# EAGLE design XBeeBoosterPack (EAGLE 6.5.0)
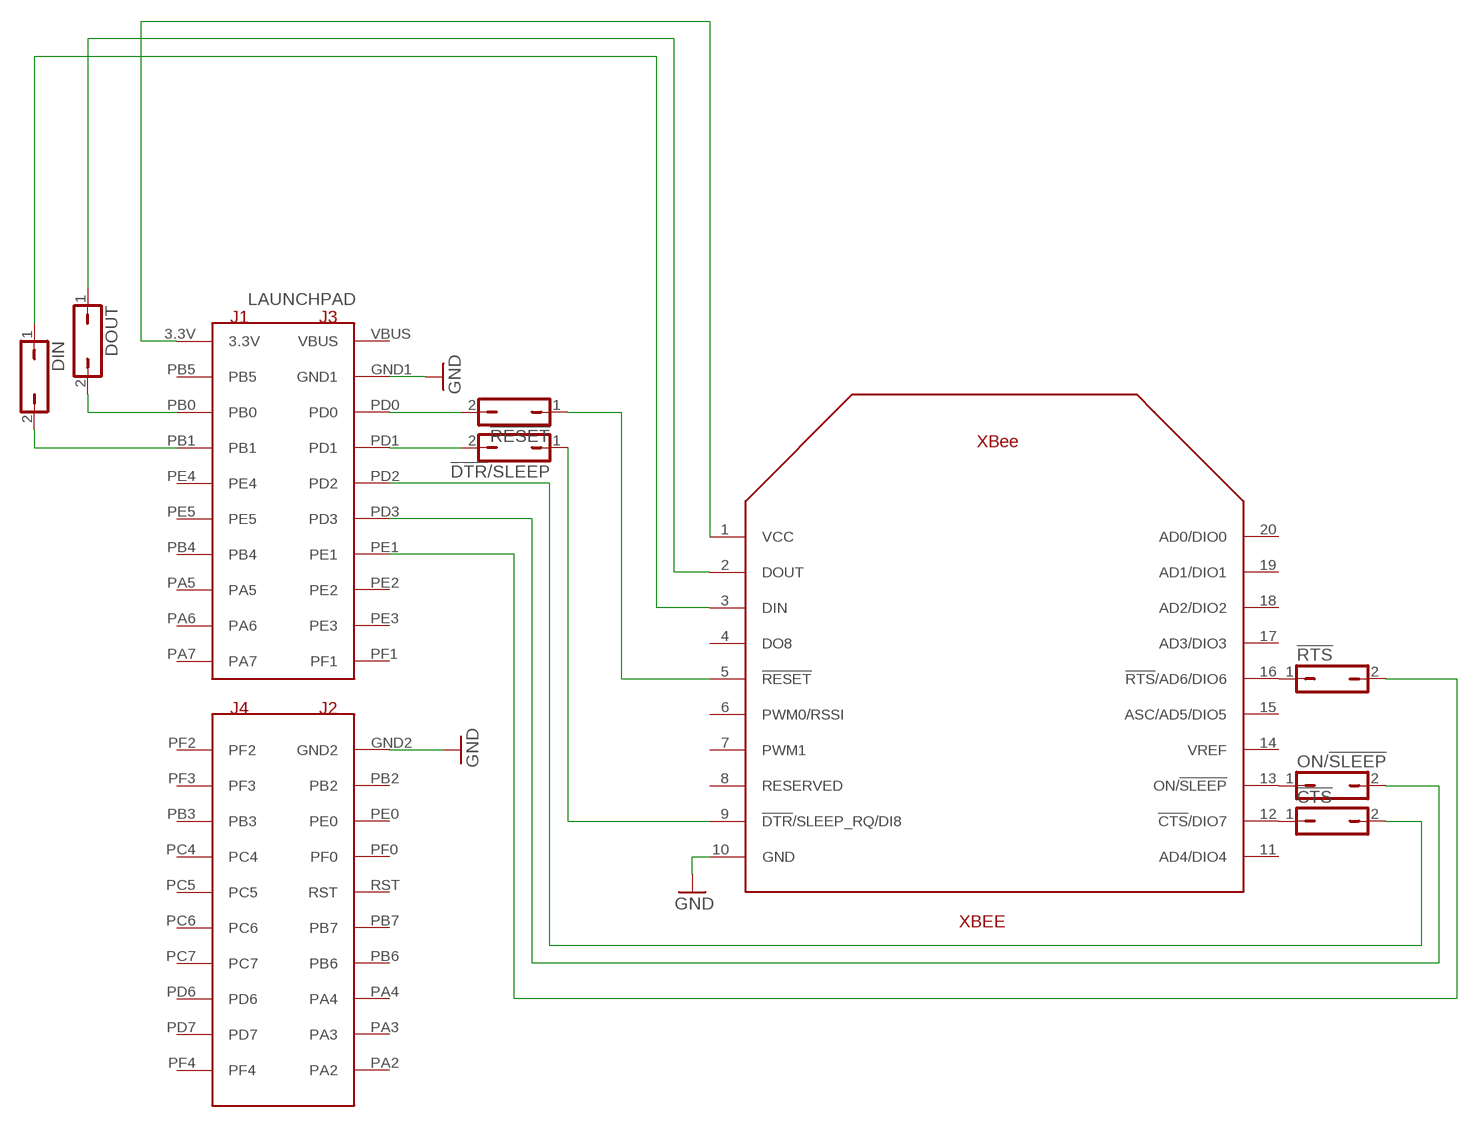
[diagram p0: schematic, sheet 1]

## Parts
!CTS!  JP1Q  [JP1]
!DTR!/SLEEP  JP1Q  [JP1]
!RESET  JP1Q  [JP1]
!RTS!  JP1Q  [JP1]
DIN  JP1Q  [JP1]
DOUT  JP1Q  [JP1]
LAUNCHPAD  STELLARIS_LAUNCHPAD_BLIZZARD_XL_HEADERS  [STELLARISLAUNCHPADHEADERS]
ON/!SLEEP!  JP1Q  [JP1]
XBEE  XBEE_HEADERS  [XBEE_HEADERS]

## Nets
GND: LAUNCHPAD.GND1 LAUNCHPAD.GND2 XBEE.10(GND)
N$1: DOUT.1 XBEE.2(DOUT)
N$2: LAUNCHPAD.3.3V XBEE.1(VCC)
N$3: DOUT.2 LAUNCHPAD.PB0
N$4: DIN.1 XBEE.3(DIN)
N$5: DIN.2 LAUNCHPAD.PB1
N$6: !RESET.2 LAUNCHPAD.PD0
N$7: !RESET.1 XBEE.5(!RESET)
N$8: !DTR!/SLEEP.2 LAUNCHPAD.PD1
N$10: !DTR!/SLEEP.1 XBEE.9(!DTR!/SLEEP_RQ/DI8)
N$13: !RTS!.1 XBEE.16(!RTS!/AD6/DIO6)
N$14: ON/!SLEEP!.1 XBEE.13(ON/!SLEEP!)
N$15: !CTS!.1 XBEE.12(!CTS!/DIO7)
N$16: !CTS!.2 LAUNCHPAD.PD2
N$17: LAUNCHPAD.PD3 ON/!SLEEP!.2
N$18: !RTS!.2 LAUNCHPAD.PE1
Unconnected: LAUNCHPAD.PA2 LAUNCHPAD.PA3 LAUNCHPAD.PA4 LAUNCHPAD.PA5 LAUNCHPAD.PA6 LAUNCHPAD.PA7 LAUNCHPAD.PB2 LAUNCHPAD.PB3 LAUNCHPAD.PB4 LAUNCHPAD.PB5 LAUNCHPAD.PB6 LAUNCHPAD.PB7 LAUNCHPAD.PC4 LAUNCHPAD.PC5 LAUNCHPAD.PC6 LAUNCHPAD.PC7 LAUNCHPAD.PD6 LAUNCHPAD.PD7 LAUNCHPAD.PE0 LAUNCHPAD.PE2 LAUNCHPAD.PE3 LAUNCHPAD.PE4 LAUNCHPAD.PE5 LAUNCHPAD.PF0 LAUNCHPAD.PF1 LAUNCHPAD.PF2 LAUNCHPAD.PF3 LAUNCHPAD.PF4 XBEE.4(DO8) XBEE.6(PWM0/RSSI) XBEE.7(PWM1) XBEE.8(RESERVED) XBEE.11(AD4/DIO4) XBEE.14(VREF) XBEE.15(ASC/AD5/DIO5) XBEE.17(AD3/DIO3) XBEE.18(AD2/DIO2) XBEE.19(AD1/DIO1) XBEE.20(AD0/DIO0)

## Power pins joined to a net without a drawn wire
RST: LAUNCHPAD.RST
VBUS: LAUNCHPAD.VBUS

## Library data of the parts
!CTS! !DTR!/SLEEP !RESET !RTS! DIN DOUT ON/!SLEEP! = jumper:JP1Q: JUMPER
LAUNCHPAD = AustinBlackstoneEngineeringPublic:STELLARIS_LAUNCHPAD_BLIZZARD_XL_HEADERS: Headers for Blizzard Chipline Stellaris Launchpad XL Booster Packs. Compatible with the EK-LM4F120XL and EK-TM4C123GXL Launchpads. This header can be used to set the headers correctly spaced. The rest of the board should be based around these headers headers that fit these can be ordered from Samtec.com Part Number SSW-110-23-S-D
XBEE = AustinBlackstoneEngineeringPublic:XBEE_HEADERS: XBee S1 / XBee Pro

## Board
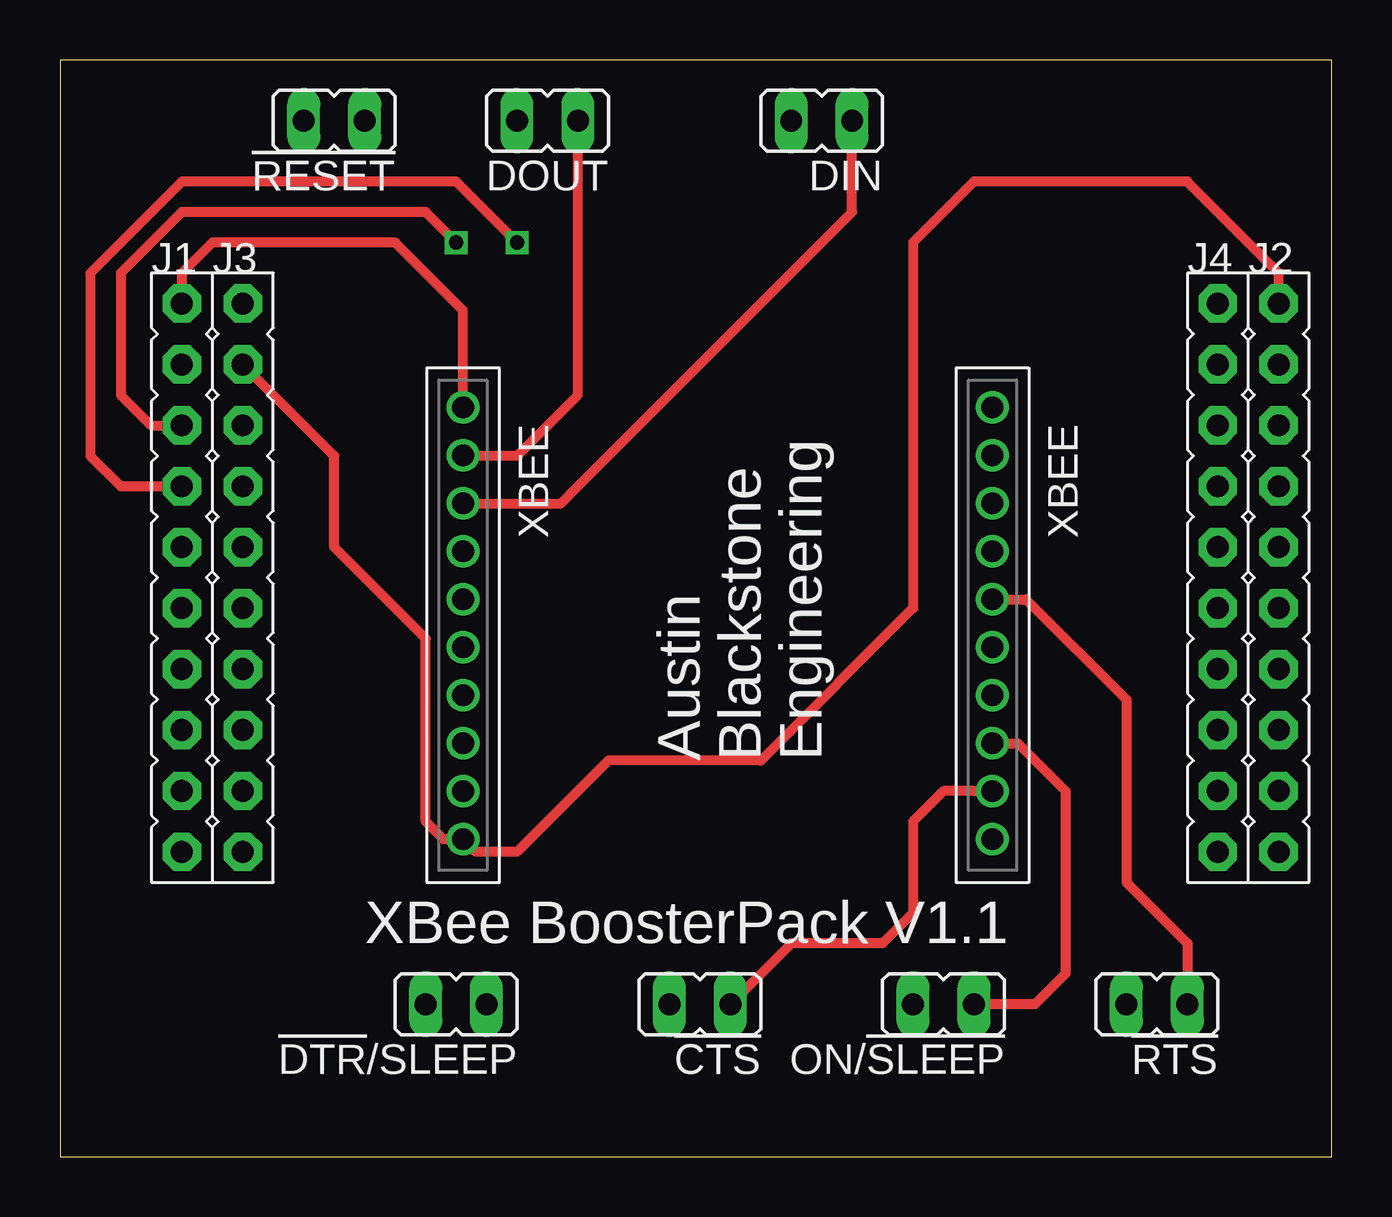
[diagram p1: board, top side]
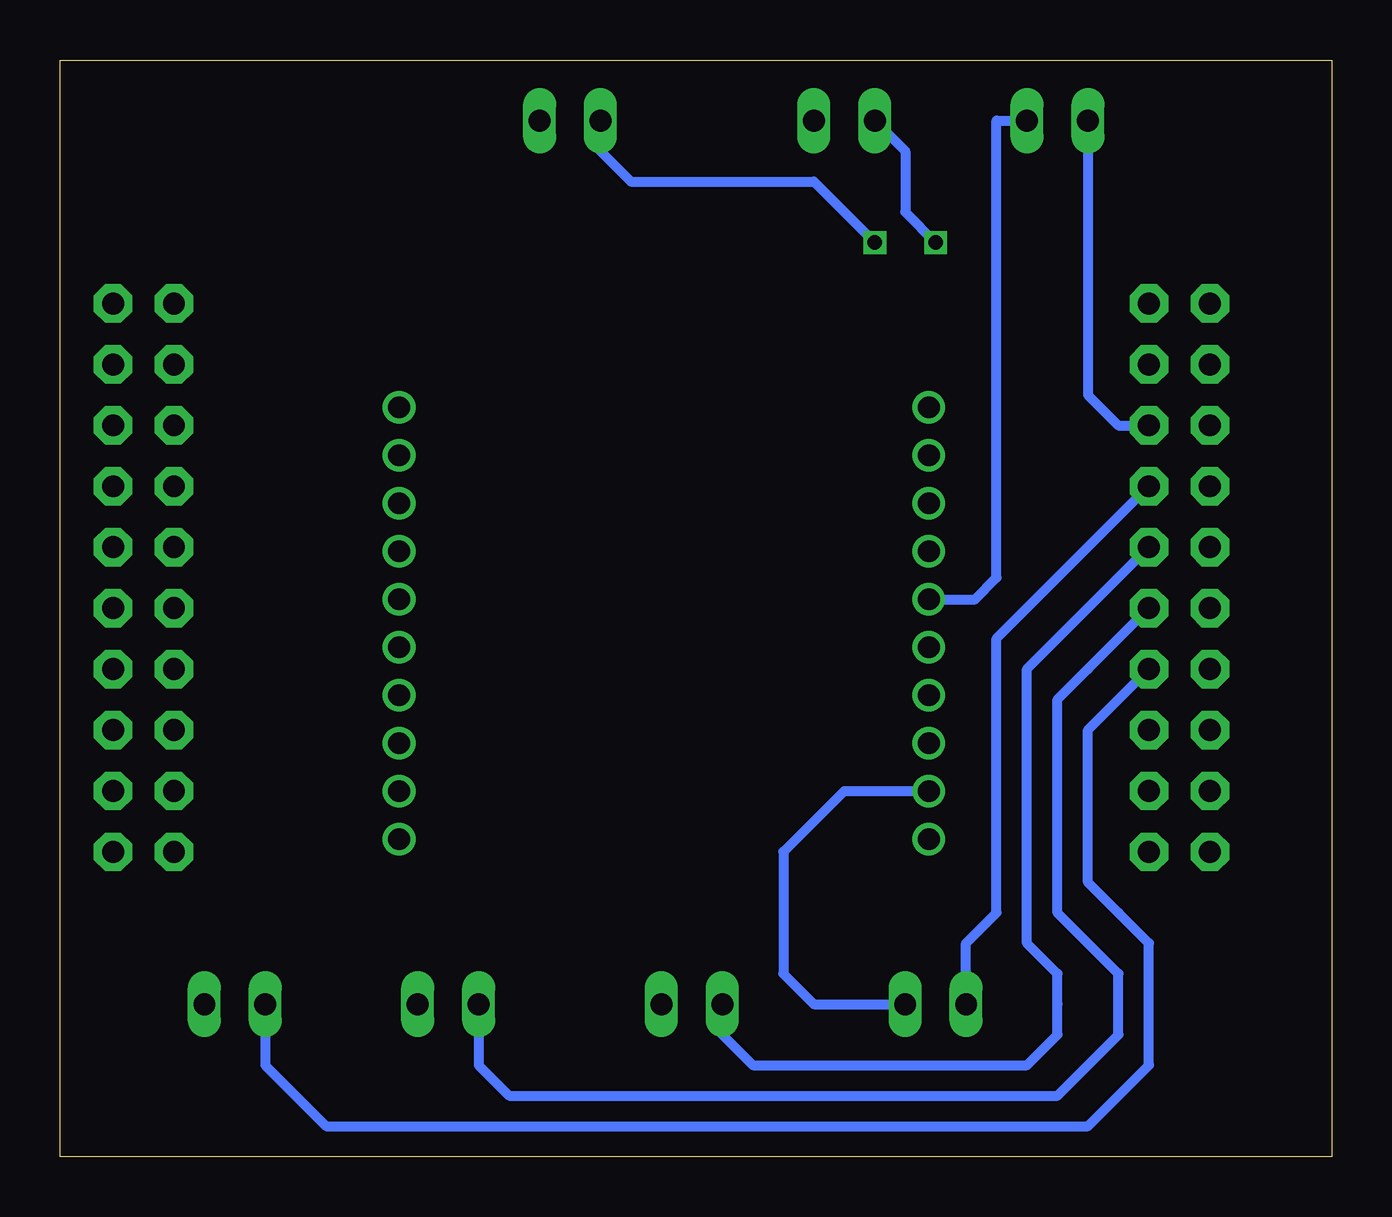
[diagram p2: board, bottom side, seen from below]

Size 53.01 x 45.71 mm. Coordinates in mm from the lower left corner, seen from the top.
Outline: 0,0 53.01,0 53.01,45.71 0,45.71 0,0
Copper layers (1*16): Top 0.0356mm / dielectric 1.5011mm / Bottom 0.0356mm
Design rules "LaenPCBOrder": minimum track width 6mil, minimum drill 13mil, track to track 6mil, track to pad 6mil, pad to pad 6mil, via to via 6mil, smd to smd 6mil, copper to edge 15mil, drill to drill 6mil, minimum pad ring 7mil, minimum via ring 7mil, stop-mask expansion 4mil, vias tented up to drill 0mil, thermal gap 10mil

### Footprints (pad centres in the part's own frame; a part is rotated, then mirrored left to right if it is on the bottom)
JP1 = drill 0.914 long: 1 0,-1.27; 2 0,1.27
STELLARISLAUNCHPADHEADERS = drill 0.914 pad 1.6 octagon: 3.3V -22.86,13.97; GND1 -20.32,11.43; GND2 22.86,13.97; PA2 22.86,-8.89; PA3 22.86,-6.35; PA4 22.86,-3.81; PA5 -22.86,-3.81; PA6 -22.86,-6.35; PA7 -22.86,-8.89; PB0 -22.86,8.89; PB1 -22.86,6.35; PB2 22.86,11.43; PB3 20.32,8.89; PB4 -22.86,-1.27; PB5 -22.86,11.43; PB6 22.86,-1.27; PB7 22.86,1.27; PC4 20.32,6.35; PC5 20.32,3.81; PC6 20.32,1.27; PC7 20.32,-1.27; PD0 -20.32,8.89; PD1 -20.32,6.35; PD2 -20.32,3.81; PD3 -20.32,1.27; PD6 20.32,-3.81; PD7 20.32,-6.35; PE0 22.86,8.89; PE1 -20.32,-1.27; PE2 -20.32,-3.81; PE3 -20.32,-6.35; PE4 -22.86,3.81; PE5 -22.86,1.27; PF0 22.86,6.35; PF1 -20.32,-8.89; PF2 20.32,13.97; PF3 20.32,11.43; PF4 20.32,-8.89; RST 22.86,3.81; VBUS -20.32,13.97
XBEE_HEADERS = drill 0.914 pad 1.372: 1 1.56,19.8; 2 1.56,17.8; 3 1.56,15.8; 4 1.56,13.8; 5 1.56,11.8; 6 1.56,9.8; 7 1.56,7.8; 8 1.56,5.8; 9 1.56,3.8; 10 1.56,1.8; 11 23.63,1.8; 12 23.63,3.8; 13 23.63,5.8; 14 23.63,7.8; 15 23.63,9.8; 16 23.63,11.8; 17 23.63,13.8; 18 23.63,15.8; 19 23.63,17.8; 20 23.63,19.8

### Placement (x,y rotation side)
!CTS!  26.67,6.35 90 top
!DTR!/SLEEP  16.51,6.35 90 top
!RESET  11.43,43.18 90 top
!RTS!  45.72,6.35 90 top
DIN  31.75,43.18 90 top
DOUT  20.32,43.18 90 top
LAUNCHPAD  27.94,21.59 0 top
ON/!SLEEP!  36.83,6.35 90 top
XBEE  15.24,11.43 0 top

### Tracks (layer width: path | path; a pad name or v marks a point on that pad's centre or on a via)
GND
  Top 0.406: LAUNCHPAD.GND2 50.8,36.83 46.99,40.64 38.1,40.64 35.56,38.1 35.56,22.86 29.21,16.51 22.86,16.51 19.05,12.7 17.33,12.7 XBEE.10 15.98,13.23 15.24,13.97 15.24,21.59 11.43,25.4 11.43,29.21 LAUNCHPAD.GND1
N$1
  Top 0.406: XBEE.2 19.07,29.23 21.59,31.75 DOUT.1
N$2
  Top 0.406: XBEE.1 16.8,35.27 13.97,38.1 6.35,38.1 5.08,36.83 LAUNCHPAD.3.3V
N$3  (via drill 0.6)
  Top 0.406: v16.51,38.1 15.24,39.37 5.08,39.37 2.54,36.83 2.54,31.75 3.81,30.48 LAUNCHPAD.PB0
  Bottom 0.406: DOUT.2 17.78,41.91 17.78,39.37 v16.51,38.1
N$4
  Top 0.406: XBEE.3 20.88,27.23 21.59,27.94 33.02,39.37 DIN.1
N$5  (via drill 0.6)
  Top 0.406: v19.05,38.1 16.51,40.64 5.08,40.64 1.27,36.83 1.27,29.21 2.54,27.94 LAUNCHPAD.PB1
  Bottom 0.406: DIN.2 30.48,41.91 29.21,40.64 21.59,40.64 v19.05,38.1
N$6
  Bottom 0.406: !RESET.2 10.16,31.75 8.89,30.48 LAUNCHPAD.PD0
N$7
  Bottom 0.406: XBEE.5 14.87,23.23 13.97,24.13 13.97,43.18 !RESET.1
N$8
  Bottom 0.406: !DTR!/SLEEP.2 15.24,8.89 13.97,10.16 13.97,21.59 LAUNCHPAD.PD1
N$10
  Bottom 0.406: XBEE.9 20.33,15.23 22.86,12.7 22.86,7.62 21.59,6.35 !DTR!/SLEEP.1
N$13
  Top 0.406: XBEE.16 40.27,23.23 44.45,19.05 44.45,11.43 46.99,8.89 !RTS!.1
N$14
  Top 0.406: XBEE.13 39.92,17.23 41.91,15.24 41.91,7.62 40.64,6.35 ON/!SLEEP!.1
N$15
  Top 0.406: XBEE.12 38.11,15.23 38.1,15.24 36.83,15.24 35.56,13.97 35.56,10.16 34.29,8.89 30.48,8.89 !CTS!.1
N$16
  Bottom 0.406: !CTS!.2 25.4,5.08 24.13,3.81 12.7,3.81 11.43,5.08 11.43,6.35 11.43,7.62 12.7,8.89 12.7,20.32 LAUNCHPAD.PD2
N$17
  Bottom 0.406: ON/!SLEEP!.2 35.56,3.81 34.29,2.54 11.43,2.54 8.89,5.08 8.89,7.62 11.43,10.16 11.43,19.05 10.16,20.32 LAUNCHPAD.PD3
N$18
  Bottom 0.406: !RTS!.2 44.45,3.81 41.91,1.27 10.16,1.27 7.62,3.81 7.62,8.89 8.89,10.16 10.16,11.43 10.16,17.78 LAUNCHPAD.PE1

### Text on the board
_tsilk: Austin | Blackstone | Engineering | XBee BoosterPack V1.1